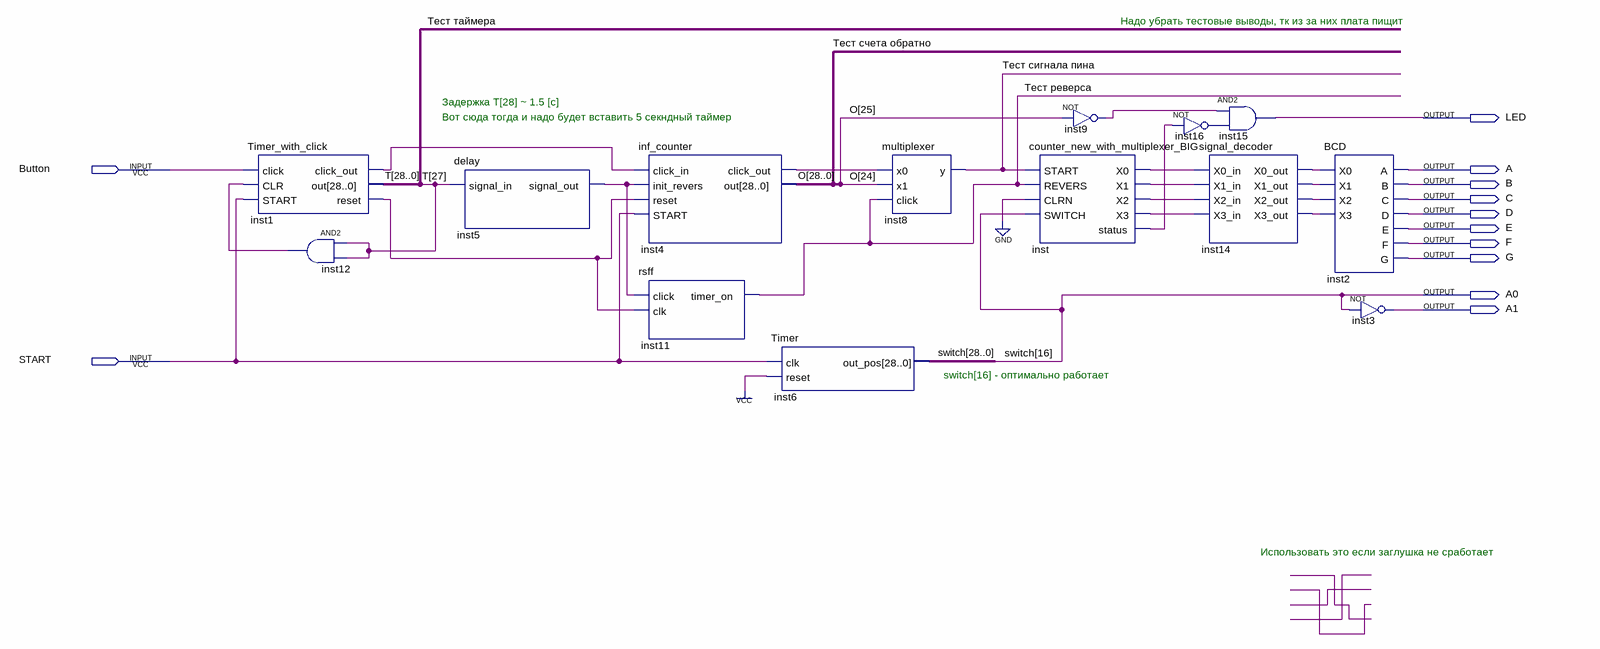
[diagram p0: schematic sheet]
// Quartus schematic my_counter_click_new.bdf as structural Verilog: 14 symbols, 12 pins
module my_counter_click_new (
  input  Button,
  input  START,
  output LED,
  output A,
  output B,
  output C,
  output D,
  output E,
  output F,
  output G,
  output A0,
  output A1
);

  wire inst1_click_out, inst1_reset, inst4_click_out, inst5_signal_out, inst8_y, inst9_out, inst11_timer_on,
       inst12_out, inst14_x0_out, inst14_x1_out, inst14_x2_out, inst14_x3_out, inst16_out, inst_status,
       inst_x0, inst_x1, inst_x2, inst_x3;
  wire [28:0] O, switch, T;

  Timer_with_click inst1 (
    .click(Button), .CLR(inst12_out), .START(START), .click_out(inst1_click_out), .out(T), .reset(inst1_reset));
  and inst12 (inst12_out, T[27], T[27]);
  delay inst5 (.signal_in(T[27]), .signal_out(inst5_signal_out));
  inf_counter inst4 (
    .click_in(inst1_click_out), .init_revers(inst5_signal_out), .reset(inst1_reset), .START(START),
    .click_out(inst4_click_out), .out(O));
  rsff inst11 (.click(inst5_signal_out), .clk(inst1_reset), .timer_on(inst11_timer_on));
  Timer inst6 (.clk(START), .reset(1'b1), .out_pos({switch[28:17], A0, switch[15:0]}));
  multiplexer inst8 (.x0(inst4_click_out), .x1(O[24]), .click(inst11_timer_on), .y(inst8_y));
  counter_new_with_multiplexer_BIG inst (
    .START(inst8_y), .REVERS(inst11_timer_on), .CLRN(1'b0), .SWITCH(A0), .X0(inst_x0), .X1(inst_x1),
    .X2(inst_x2), .X3(inst_x3), .status(inst_status));
  not inst9 (inst9_out, O[25]);
  not inst16 (inst16_out, inst_status);
  and inst15 (LED, inst9_out, inst16_out);
  signal_decoder inst14 (
    .X0_in(inst_x0), .X1_in(inst_x1), .X2_in(inst_x2), .X3_in(inst_x3), .X0_out(inst14_x0_out),
    .X1_out(inst14_x1_out), .X2_out(inst14_x2_out), .X3_out(inst14_x3_out));
  BCD inst2 (
    .X0(inst14_x0_out), .X1(inst14_x1_out), .X2(inst14_x2_out), .X3(inst14_x3_out), .A(A), .B(B), .C(C),
    .D(D), .E(E), .F(F), .G(G));
  not inst3 (A1, A0);

  // Other names for the same wires on the sheet: switch[16] = A0

  // Notes on the sheet:
  //   Тест таймера
  //   Надо убрать тестовые выводы, тк из за них плата пищит
  //   Тест счета обратно
  //   Тест сигнала пина
  //   Тест реверса
  //   Задержка Т[28] ~ 1.5 [c]
  //   Вот сюда тогда и надо будет вставить 5 секндный таймер
  //   switch[16] - оптимально работает
  //   Использовать это если заглушка не сработает
endmodule
